# Altium schematic sheet MCU.SchDoc
size A3; SheetNumber: 5; SheetTotal: 6
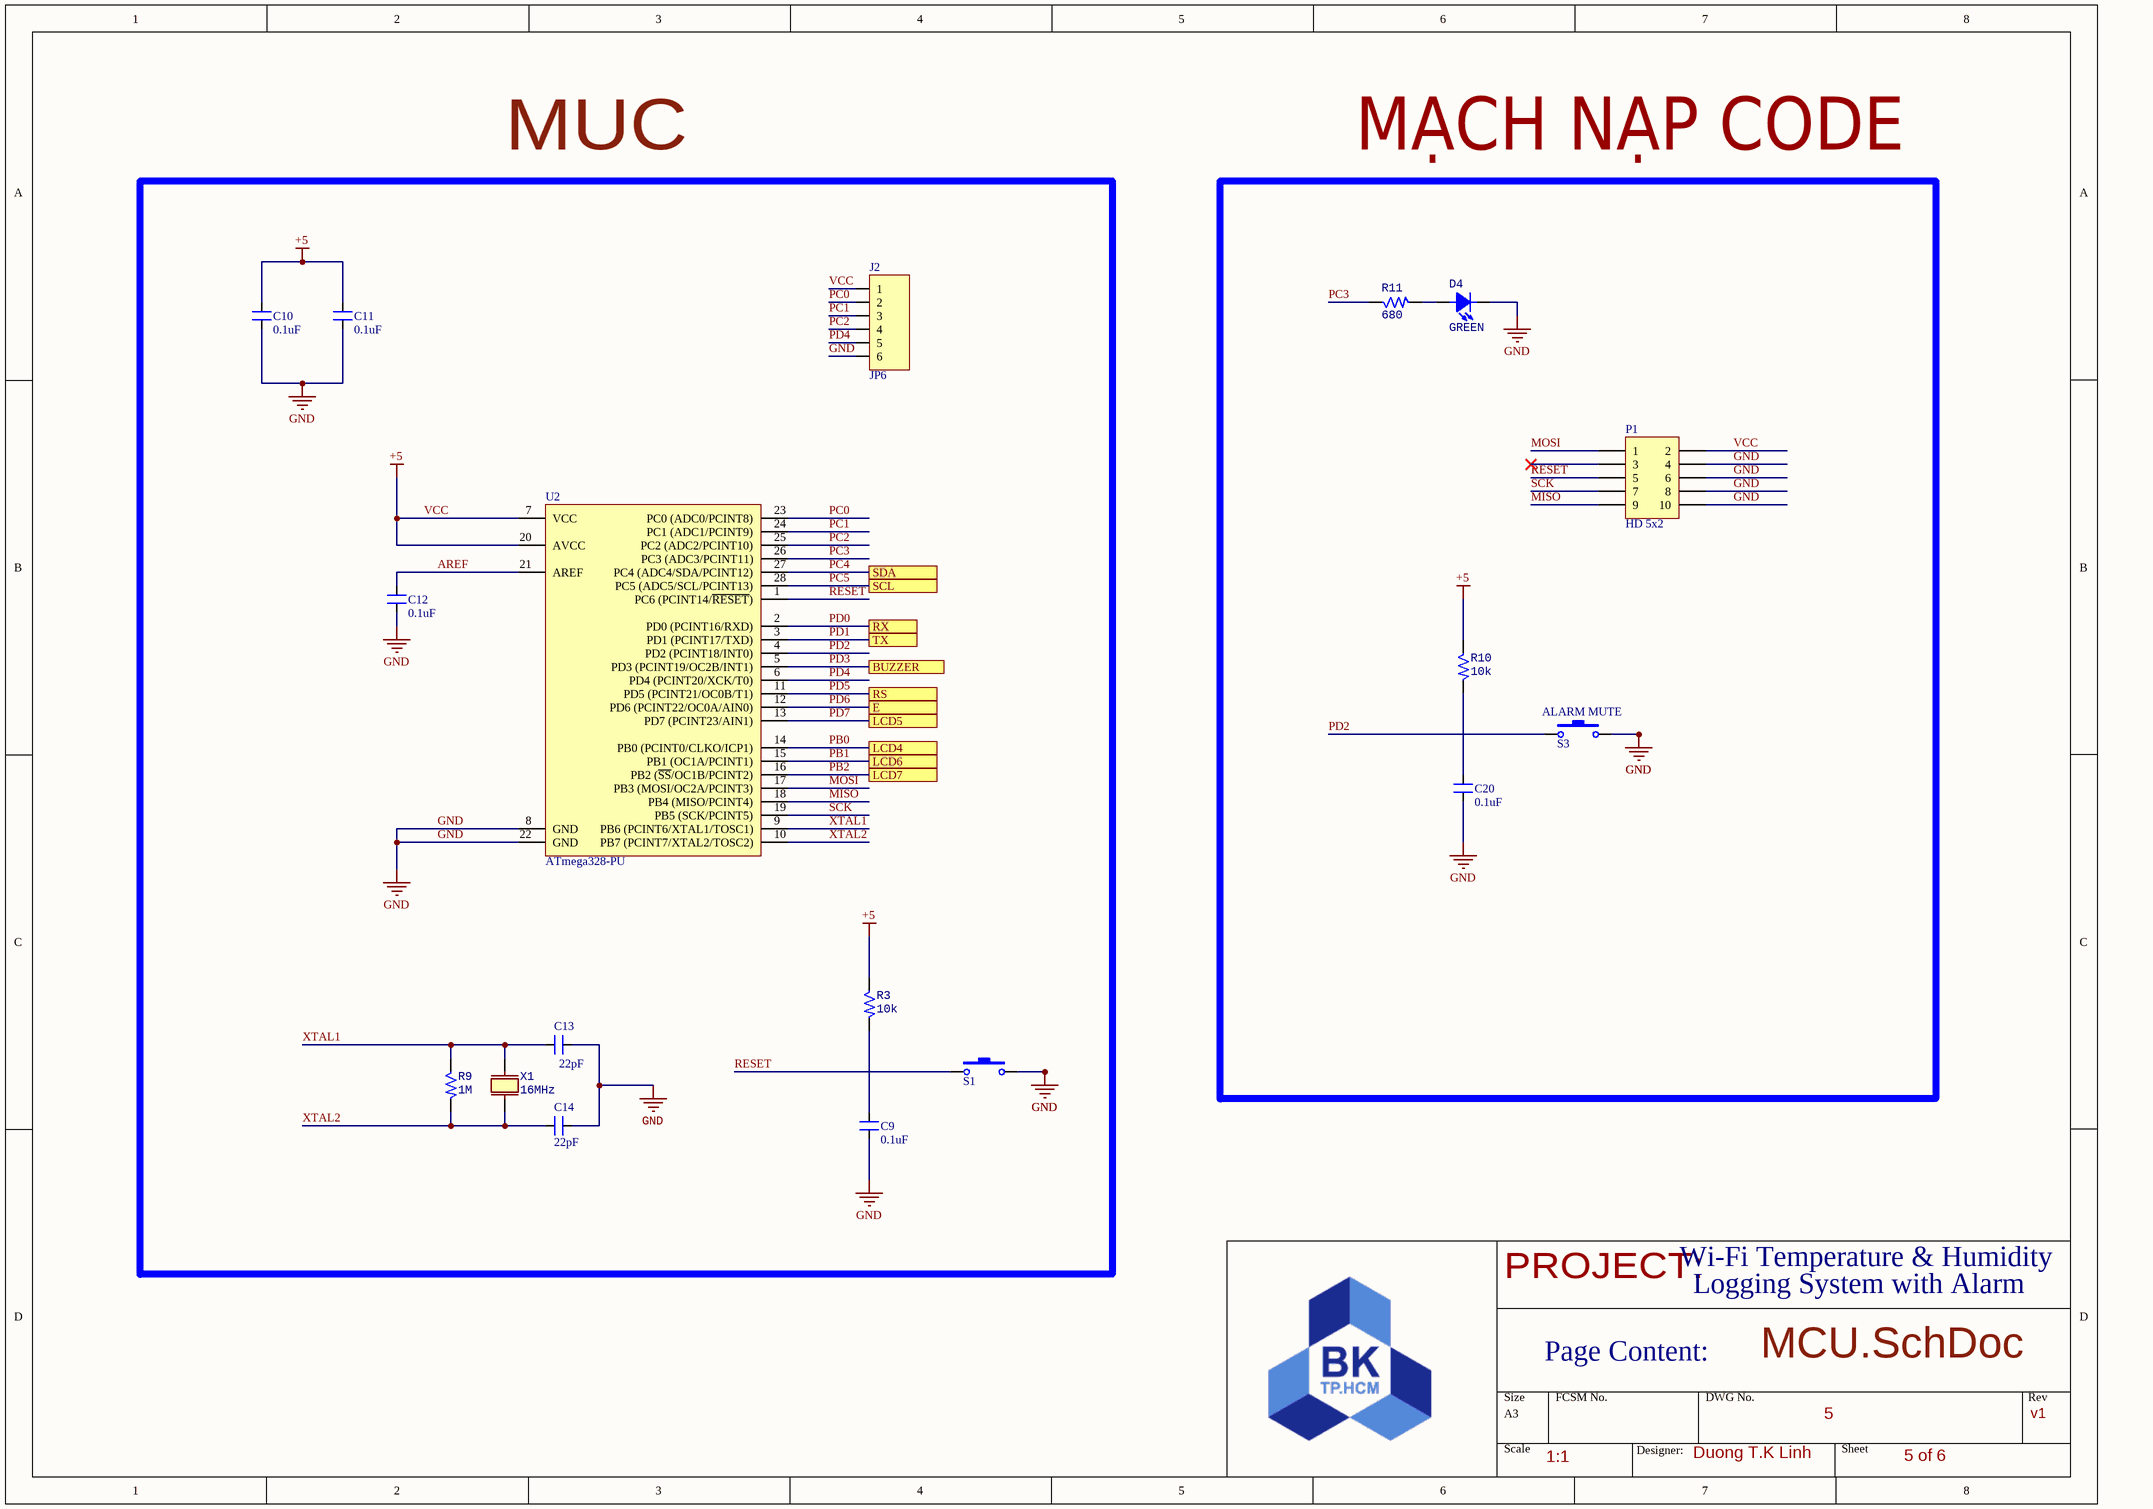
[diagram p0: MCU.SchDoc]

## Parts
C9  0.1uF  [CN2]
C10  0.1uF  [CN2]
C11  0.1uF  [CN2]
C12  0.1uF  [CN2]
C13  22pF  [CN3]
C14  22pF  [CN3]
C20  0.1uF  [CN2]
D4  GREEN  [LED-5TRED]
J2  JP6  [JP6-D1T]
P1  HD 5x2  [61201021621]
R3  10k  [RES-1/4W-SMALL]
R9  1M  [RES-1/4W-SMALL]
R10  10k  [RES-1/4W-SMALL]
R11  680  [RES-1/4W-SMALL]
S1  RESET MCU  [BUTTON  ROUND]  (value not drawn)
S3  ALARM MUTE  [BUTTON  ROUND]
U2  ATmega328-PU  [DIP28]
X1  16MHz  [XT2]

## Blocks framed on the sheet
MUC: C9-C14 J2 R3 R9 S1 U2 X1
MẠCH NẠP CODE: C20 D4 P1 R10 R11 S3

## Ports
BUZZER (see power_display), E (see power_display), LCD4 (see power_display), LCD5 (see power_display), LCD6 (see power_display), LCD7 (see power_display), RS (see power_display), RX (see sensor_wifi), SCL (see sensor_wifi), SDA (see sensor_wifi), TX (see sensor_wifi)

## Nets
GND: C9.1 C10.1 C11.1 C12.1 C13.2 C14.2 C20.1 D4.2(K) J2.6 P1.4 P1.6 P1.8 P1.10 S1.2 S3.2 U2.8(GND) U2.22(GND)
VCC: C10.2 C11.2 J2.1 P1.2 R3.1 R10.1 U2.7(VCC) U2.20(AVCC)  [also labelled +5]
AREF: C12.2 U2.21(AREF)
MISO: P1.9 U2.18(PB4_(MISO/PCINT4))
MOSI: P1.1 U2.17(PB3_(MOSI/OC2A/PCINT3))
PB0: U2.14(PB0_(PCINT0/CLKO/ICP1)) ; port LCD4
PB1: U2.15(PB1_(OC1A/PCINT1)) ; port LCD6
PB2: U2.16(PB2_(~{SS}/OC1B/PCINT2)) ; port LCD7
PC0: J2.2 U2.23(PC0_(ADC0/PCINT8))
PC1: J2.3 U2.24(PC1_(ADC1/PCINT9))
PC2: J2.4 U2.25(PC2_(ADC2/PCINT10))
PC3: R11.1 U2.26(PC3_(ADC3/PCINT11))
PC4: U2.27(PC4_(ADC4/SDA/PCINT12)) ; port SDA
PC5: U2.28(PC5_(ADC5/SCL/PCINT13)) ; port SCL
PD0: U2.2(PD0_(PCINT16/RXD)) ; port RX
PD1: U2.3(PD1_(PCINT17/TXD)) ; port TX
PD2: S3.1 U2.4(PD2_(PCINT18/INT0))
PD3: U2.5(PD3_(PCINT19/OC2B/INT1)) ; port BUZZER
PD4: J2.5 U2.6(PD4_(PCINT20/XCK/T0))
PD5: U2.11(PD5_(PCINT21/OC0B/T1)) ; port RS
PD6: U2.12(PD6_(PCINT22/OC0A/AIN0)) ; port E
PD7: U2.13(PD7_(PCINT23/AIN1)) ; port LCD5
RESET: P1.5 S1.1 U2.1(PC6_(PCINT14/~{RESET}))
SCK: P1.7 U2.19(PB5_(SCK/PCINT5))
XTAL1: C13.1 R9.1 U2.9(PB6_(PCINT6/XTAL1/TOSC1)) X1.2
XTAL2: C14.1 R9.2 U2.10(PB7_(PCINT7/XTAL2/TOSC2)) X1.1
NetC9_2: C9.2 R3.2
NetC20_2: C20.2 R10.2
NetD4_1: D4.1(A) R11.2

Not connected (* = marked no-connect by the designer): P1 3*

## Notes on the sheet
- PROJECT:
- Wi-Fi Temperature & Humidity
- Logging System with Alarm
- Page Content:
- MCU.SchDoc
- 1:1
- Designer:
- Duong T.K Linh
- 5
- 5 of 6
- v1

## Library data of the parts
C9-C12 C20 = CN2: Cap np 104 => 105pF; Value: 0.1uF
C13 C14 = CN3: Cap np W0.3; Value: 0,047uF; Copyright: VanDungEvn
D4 = ID-23: Green 569nm LED Indication - Discrete 2.1V 0603 (1608 Metric); Mfr# #: LTST-C190GKT; Design Item ID: ID-23; Value: GREEN
J2 = JP6: WR-PHD 2.54 mm Angled Socket Header; Manufacturer: W¨¹rth Elektronik eiSos GmbH; partNo: 613006143121; ComponentLink1 Description: Manufacturer; ComponentLink2 Description: Datasheet; NoPins: 06; Created Date: 29 March 2013; ComponentLink1URL: http://www.we-online.com; ComponentLink2URL: http://katalog.we-online.de/em/datasheet/6130xx143121.pdf; Created by: Karrer Zheng
R3 R9-R11 = RES-SMD
S1 S3 = SW-Button: Switch-Button; Published: 24-Mar-1999; LatestRevisionDate: 17-Jul-2002; LatestRevisionNote: Re-released for DXP Platform.; PackageReference: SPST-2; Publisher: Altium Limited
U2 = ATmega328-PU: 8-bit AVR Microcontroller, 32KB Flash, 1KB EEPROM, 2KB SRAM, 28-pin PDIP, Industrial Grade (-40°C to 85°C); Published: 1-Apr-2010; DatasheetVersion: revA, Jan-2010; PackageVersion: revB, Sep-2001; PackageReference: 28P3; Publisher: Altium Limited; PackageDescription: 28-lead (0.300"/7.62mm Wide) Plastic Dual Inline Package (PDIP); Supplier 1: Digi-Key; Supplier Part Number 1: ATMEGA328-PU-ND; Supplier 2: Mouser; Supplier Part Number 2: 556-ATMEGA328-PU; ComponentLink1Description: Manufacturer Link; ComponentLink1URL: http://www.atmel.com/products/avr/default.asp?; ComponentLink2Description: ATmega48A/48PA/88A/88PA/168A/168PA/328/328P Datasheet; ComponentLink2URL: http://www.atmel.com/dyn/resources/prod_documents/8271.pdf; ComponentLink3Description: ATmega48A/48PA/88A/88PA/168A/168PA/328/328P Summary; ComponentLink3URL: http://www.atmel.com/dyn/resources/prod_documents/8271S.pdf; ComponentLink4Description: Atmel.com Home; ComponentLink4URL: http://www.atmel.com
X1 = CRYSTAL 2PIN: Part Number: ABS07-120-32.768KHZ-T; Value: 32.768kHz